# EAGLE design PWM board 1.2 (EAGLE 7.2.0)
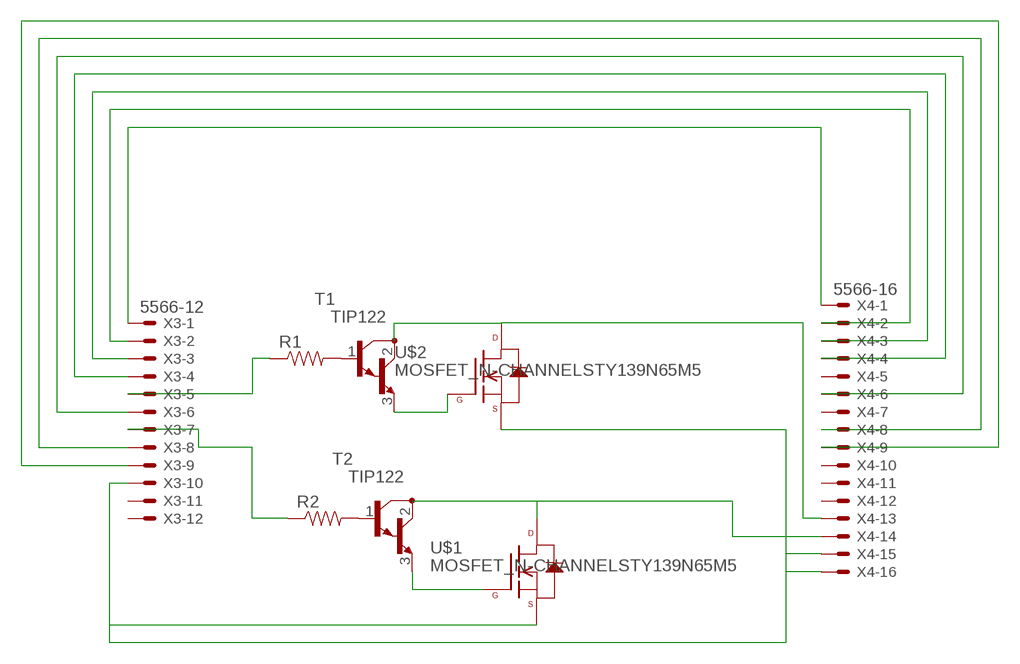
[diagram p0: schematic, sheet 1]

## Parts
R1  RESISTORPTH-1/2W  [AXIAL-0.5]
R2  RESISTORPTH-1/2W  [AXIAL-0.5]
T1  TIP122  [TO220]
T2  TIP122  [TO220]
U$1  MOSFET_N-CHANNELSTY139N65M5  [TO-264_MAX247]
U$2  MOSFET_N-CHANNELSTY139N65M5  [TO-264_MAX247]
X3  5566-12  [5566-12]
X4  5566-16  [5566-16]

## Nets
N$1: T1.2(C) U$2.P2(DRAIN) X4.13
N$2: T2.2(C) U$1.P2(DRAIN) X4.14
N$3: T2.3(E) U$1.P1(GATE)
N$4: T1.3(E) U$2.P1(GATE)
N$5: R1.P$2 T1.1(B)
N$6: R2.P$2 T2.1(B)
N$7: R1.P$1 X3.5
N$8: R2.P$1 X3.7
N$9: X3.1 X4.1
N$10: X3.2 X4.2
N$11: X3.3 X4.3
N$12: X3.4 X4.4
N$13: U$1.P3(SOURCE) U$2.P3(SOURCE) X3.10 X4.15 X4.16
N$14: X3.6 X4.6
N$15: X3.8 X4.8
N$16: X3.9 X4.9
Unconnected: X3.11 X3.12 X4.5 X4.7 X4.10 X4.11 X4.12

## Library data of the parts
R1 R2 = HyTech 2016:RESISTOR: Resistor Basic schematic elements and footprints for 0603, 1206, and PTH resistors.
T1 T2 = transistor:TIP122: NPN BIPOLAR DARLINGTON TRANSISTOR
U$1 U$2 = HyTech 2016:MOSFET_N-CHANNEL: N-Channel MOSFET Mode Field Effect Transistor
X3 = con-molex:5566-12: Mini FIT connector 12 pol Source: http://www.molex.com; OC_FARNELL: unknown; OC_NEWARK: unknown
X4 = con-molex:5566-16: Mini FIT connector 16 pol Source: http://www.molex.com; OC_FARNELL: unknown; OC_NEWARK: unknown

## Board
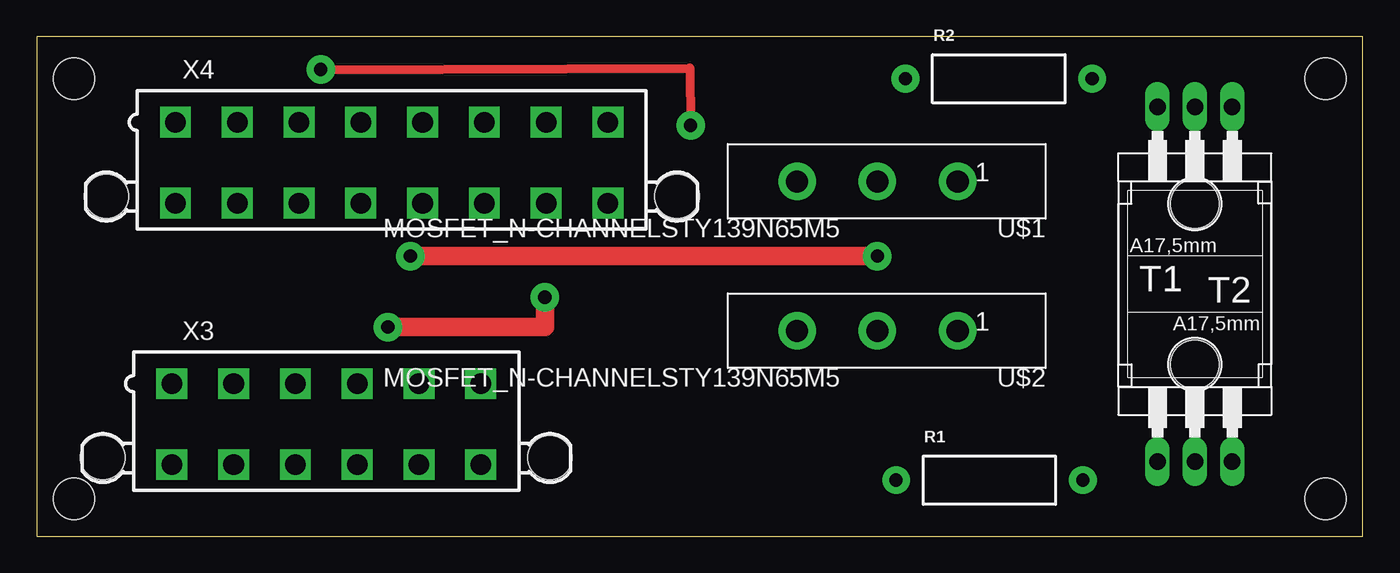
[diagram p1: board, top side]
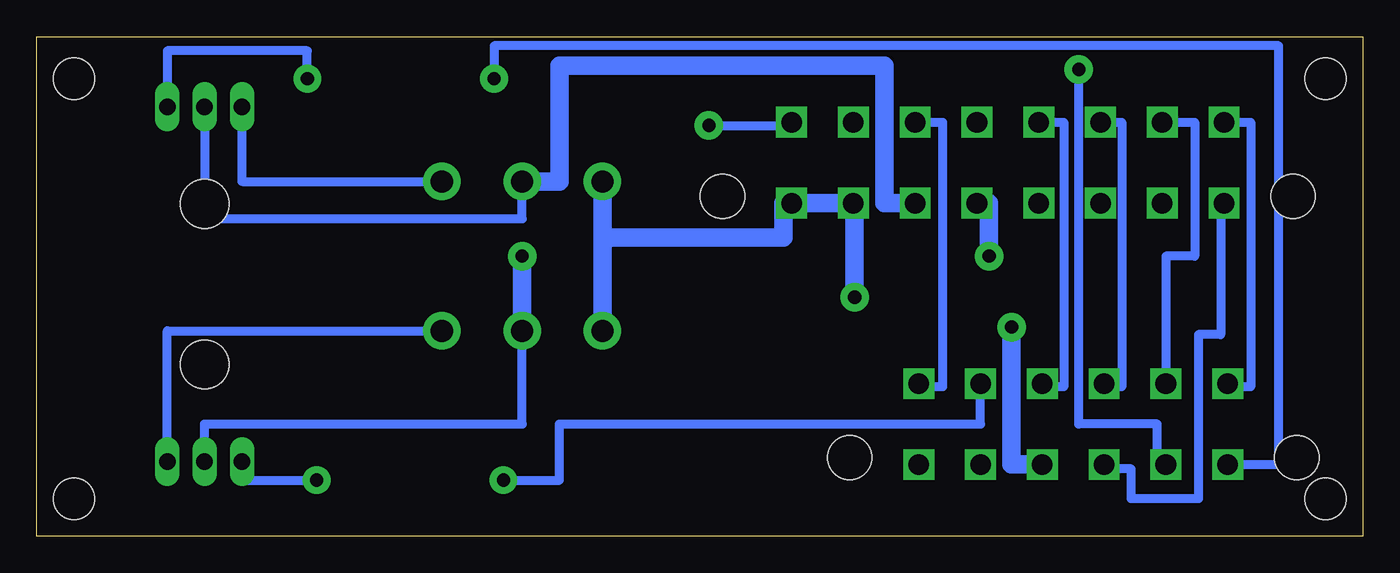
[diagram p2: board, bottom side, seen from below]

Size 90.15 x 33.96 mm. Coordinates in mm from the lower left corner, seen from the top.
Outline: 0,0 90.15,0 90.15,33.96 0,33.96 0,0
Copper layers (1*16): Top 0.035mm / dielectric 1.5mm / Bottom 0.035mm
Design rules "default": minimum track width 10mil, minimum drill 24mil, track to track 8mil, track to pad 8mil, pad to pad 8mil, via to via 8mil, smd to smd 8mil, copper to edge 40mil, drill to drill 8mil, minimum pad ring 10mil, minimum via ring 8mil, stop-mask expansion 4mil, vias tented up to drill 0mil, thermal gap 10mil
Holes 2.8 mm at 2.54,31.11 2.54,2.54 87.63,2.54 87.63,31.11

### Footprints (pad centres in the part's own frame; a part is rotated, then mirrored left to right if it is on the bottom)
AXIAL-0.5 = drill 0.9 pad 1.88: P$1 -6.35,0; P$2 6.35,0
TO220 = drill 1.118 long: 1 -2.54,-6.35; 2 0,-6.35; 3 2.54,-6.35 | hole 3.302: 0,11.176
TO-264_MAX247 = drill 1.5 pad 2.54: P1 -5.461,0; P2 0,0; P3 5.461,0
5566-12 = drill 1.4 square: 1 10.5,-2.75; 2 6.3,-2.75; 3 2.1,-2.75; 4 -2.1,-2.75; 5 -6.3,-2.75; 6 -10.5,-2.75; 7 10.5,2.75; 8 6.3,2.75; 9 2.1,2.75; 10 -2.1,2.75; 11 -6.3,2.75; 12 -10.5,2.75 | hole 3: 15.2,2.29; -15.2,2.29
5566-16 = drill 1.4 square: 1 14.7,-2.75; 2 10.5,-2.75; 3 6.3,-2.75; 4 2.1,-2.75; 5 -2.1,-2.75; 6 -6.3,-2.75; 7 -10.5,-2.75; 8 -14.7,-2.75; 9 14.7,2.75; 10 10.5,2.75; 11 6.3,2.75; 12 2.1,2.75; 13 -2.1,2.75; 14 -6.3,2.75; 15 -10.5,2.75; 16 -14.7,2.75 | hole 3: 19.4,2.29; -19.4,2.29

### Placement (x,y rotation side)
R1  64.77,3.81 0 top
R2  65.41,31.11 0 top
T1  78.74,11.43 0 top
T2  78.74,22.86 180 top
U$1  57.15,24.13 180 top
U$2  57.15,13.97 180 top
X3  19.69,7.62 180 top
X4  24.13,25.4 180 top

### Tracks (layer width: path | path; a pad name or v marks a point on that pad's centre or on a via)
N$1  (via drill 0.9 pad 1.93)
  Top 1.27: v25.4,19.05 v57.15,19.05
  Bottom 0.61: T1.2 78.74,7.62 57.15,7.62 U$2.P2
  Bottom 1.27: X4.13 25.4,22.65 v25.4,19.05 | v57.15,19.05 U$2.P2
N$2
  Bottom 0.61: T2.2 78.74,21.59 57.15,21.59 U$1.P2
  Bottom 1.27: X4.14 32.51,22.65 32.51,32 54.61,32 54.61,24.13 U$1.P2
N$3
  Bottom 0.61: T2.3 76.2,24.13 U$1.P1
N$4
  Bottom 0.61: T1.3 81.28,13.97 U$2.P1
N$5
  Bottom 0.61: T1.1 76.2,3.81 R1.P$2
N$6
  Bottom 0.61: R2.P$2 71.76,33.02 81.28,33.02 T2.1
N$7
  Bottom 0.61: X3.5 25.99,7.62 54.61,7.62 54.61,3.81 R1.P$1
N$8
  Bottom 0.61: X3.7 5.72,4.87 5.72,33.36 59.06,33.36 R2.P$1
N$9
  Bottom 0.61: X4.1 7.62,28.15 7.62,10.16 8.55,10.16 X3.1
N$10
  Bottom 0.61: X4.2 11.43,28.15 11.43,19.05 13.39,19.05 X3.2
N$11
  Bottom 0.61: X4.3 16.38,28.15 16.38,10.16 17.59,10.16 X3.3
N$12
  Bottom 0.61: X4.4 20.32,28.15 20.32,10.16 21.79,10.16 X3.4
N$13  (via drill 0.9 pad 1.93)
  Top 1.27: v23.88,14.22 34.54,14.22 v34.54,16.26
  Bottom 1.27: U$1.P3 51.69,20.32 | 51.69,20.32 U$2.P3 | X3.10 23.88,4.87 v23.88,14.22 | v34.54,16.26 34.54,22.65 X4.15 X4.16 39.37,22.65 39.37,20.32 51.69,20.32
N$14
  Bottom 0.61: X4.6 28.58,28.15 28.58,10.16 30.19,10.16 X3.6
N$15  (via drill 0.9 pad 1.93)
  Top 0.61: v19.3,31.74 44.4,31.84 v44.45,27.94
  Bottom 0.61: X3.8 13.97,4.87 13.97,7.62 19.3,7.62 v19.3,31.74 | v44.45,27.94 38.83,27.94 X4.8
N$16
  Bottom 0.61: X4.9 9.65,22.65 9.65,13.72 11.18,13.72 11.18,2.54 15.75,2.54 15.75,4.57 17.59,4.57 X3.9

### Text on the board
200bmp: C:/Users/Remember-Genuine/Documents/School at GT/Spring 2016/HyTech/2016 Logo black.bmp | C:/Users/Remember-Genuine/Documents/School at GT/Spring 2016/HyTech/GT.bmp